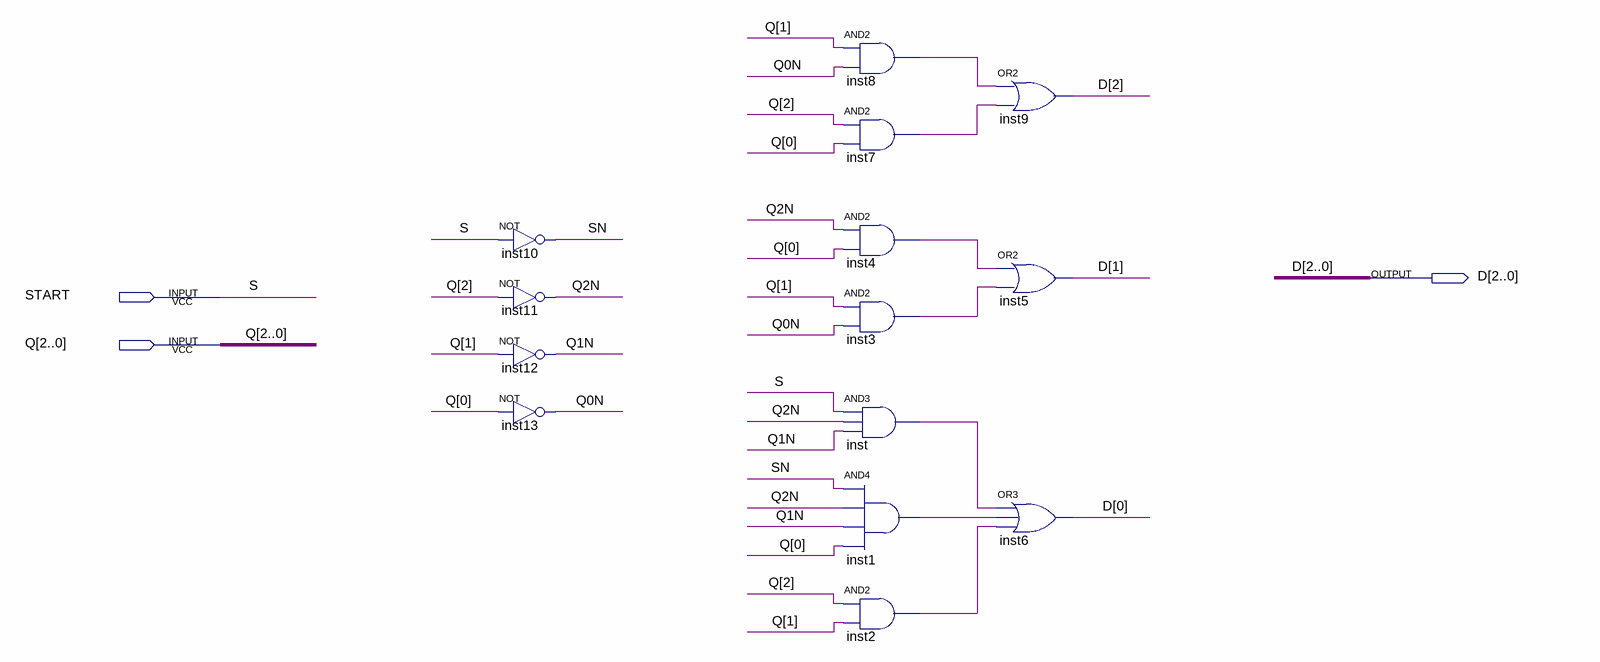
[diagram p0: schematic sheet]
// Quartus schematic NEXT_STATE.bdf as structural Verilog: 14 symbols, 3 pins
module NEXT_STATE (
  input  START,
  input  [2:0] Q,
  output [2:0] D
);

  wire inst1_out, inst2_out, inst3_out, inst4_out, inst7_out, inst8_out, inst_out, Q0N, Q1N, Q2N, SN;

  not inst10 (SN, START);
  not inst11 (Q2N, Q[2]);
  not inst12 (Q1N, Q[1]);
  not inst13 (Q0N, Q[0]);
  and inst8 (inst8_out, Q[1], Q0N);
  and inst7 (inst7_out, Q[2], Q[0]);
  and inst4 (inst4_out, Q2N, Q[0]);
  and inst3 (inst3_out, Q[1], Q0N);
  and inst (inst_out, START, Q2N, Q1N);
  and inst1 (inst1_out, SN, Q2N, Q1N, Q[0]);
  and inst2 (inst2_out, Q[2], Q[1]);
  or inst9 (D[2], inst8_out, inst7_out);
  or inst5 (D[1], inst4_out, inst3_out);
  or inst6 (D[0], inst_out, inst1_out, inst2_out);

  // Other names for the same wires on the sheet: S = START
endmodule
